# Altium schematic sheet Audio.SchDoc
size A; SheetNumber: 2; SheetTotal: 10
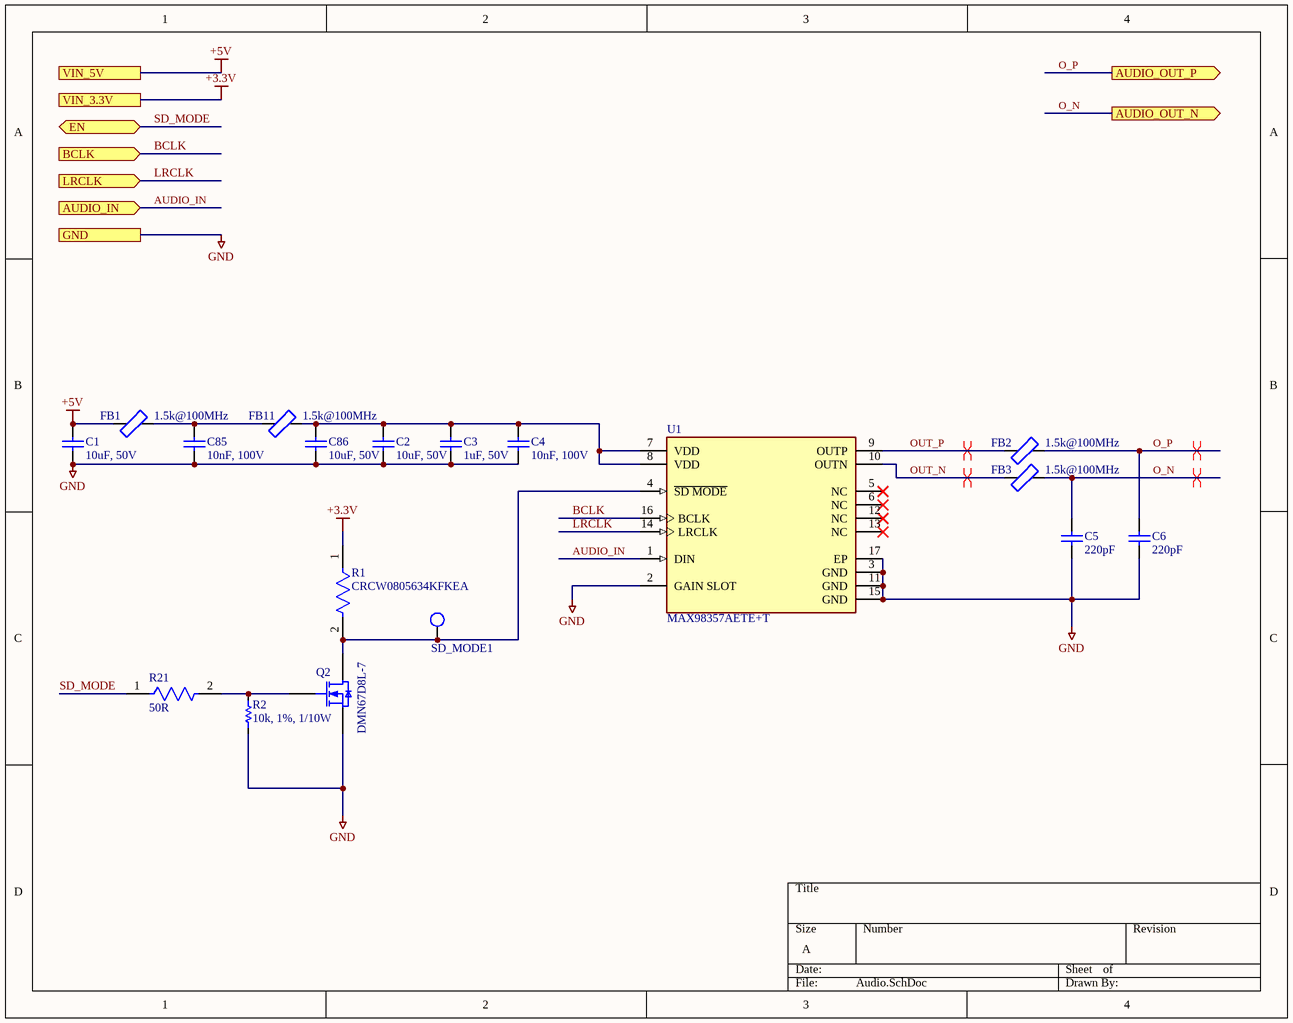
[diagram p0: Audio.SchDoc]

## Parts
C1  10uF, 50V  [1206]
C2  10uF, 50V  [1206]
C3  1uF, 50V  [0805]
C4  10nF, 100V  [0603]
C5  220pF  [CAPC2013X88X50LL20T25]
C6  220pF  [CAPC2013X88X50LL20T25]
C85  10nF, 100V  [0603]
C86  10uF, 50V  [1206]
FB1  1.5k@100MHz  [0805]
FB2  1.5k@100MHz  [0805]
FB3  1.5k@100MHz  [0805]
FB11  1.5k@100MHz  [0805]
Q2  DMN67D8L-7  [SOT23-3]
R1  CRCW0805634KFKEA  [FP-CRCW0805-e3-MFG]
R2  10k, 1%, 1/10W  [0603]
R21  50R  [FP-RCP0603W-MFG]
SD_MODE1  2mm  [TEST POINT 40 Mil]  (value not drawn)  (no BOM)
U1  MAX98357AETE+T  [FP-T1633-4-MFG]

## Ports
AUDIO_IN (in), AUDIO_OUT_N (out), AUDIO_OUT_P (out), BCLK (in), EN (bidir), GND, LRCLK (in), VIN_3.3V, VIN_5V

## Nets
+3.3V: R1.1 ; port VIN_3.3V
+5V: C1.2 FB1.1 ; port VIN_5V
GND: C1.1 C2.1 C3.1 C4.2 C5.1 C6.1 C85.2 C86.1 Q2.2(S) R2.2 U1.2(GAIN_SLOT) U1.3(GND) U1.11(GND) U1.15(GND) U1.17(EP) ; port GND
AUDIO_IN: U1.1(DIN) ; port AUDIO_IN
BCLK: U1.16(BCLK) ; port BCLK
LRCLK: U1.14(LRCLK) ; port LRCLK
O_N: C5.2 FB3.2 ; port AUDIO_OUT_N
O_P: C6.2 FB2.2 ; port AUDIO_OUT_P
OUT_N: FB3.1 U1.10(OUTN)
OUT_P: FB2.1 U1.9(OUTP)
SD_MODE: R21.1 ; port EN
NetC2_2: C2.2 C3.2 C4.1 C86.2 FB11.2 U1.7(VDD) U1.8(VDD)
NetC85_1: C85.1 FB1.2 FB11.1
NetQ2_1: Q2.1(G) R2.1 R21.2
NetQ2_3: Q2.3(D) R1.2 SD_MODE1.1(TP) U1.4(~{SD_MODE})

Not connected (* = marked no-connect by the designer): U1 5(NC)* 6(NC)* 12(NC)* 13(NC)*

## Layout directives
differential pair: O_N, O_P, OUT_N, OUT_P

## Library data of the parts
C1 C2 C86 = NS00832: CAP CER 10UF 50V X7R 1206; Type: C; Alternatives: Generic; Part Number: NS00832; Value: 10uF, 50V; Supplier 1: Digi-Key; Supplier Part Number 1: 1276-6767-1-ND
C3 = NS00871: CAP CER 1UF 50V X7R 0805; Type: C; Alternatives: Generic; Part Number: NS00871; Value: 1uF, 50V; Supplier 1: Digi-Key; Supplier Part Number 1: 1276-6470-1-ND
C4 C85 = NS00848: CAP CER 10000PF 100V C0G 0603; Type: C; Alternatives: Generic; Part Number: NS00848; Value: 10nF, 100V; Supplier 1: Digi-Key; Supplier Part Number 1: 445-172665-1-ND
C5 C6 = CMP-1036-02336-2: Part Number: C0805C221J2GACTU; Manufacturer: Kemet
FB1-FB3 FB11 = NS00881: WE-CBA SMT EMI SUPPRESSION FERRITE; Type: Inductor; Part Number: NS00881; Value: 1.5k@100MHz; ComponentLink1Description: Datasheet; ComponentLink1URL: H:\Doc\Wurth\782853162.pdf; Supplier 1: Digi-Key; Supplier Part Number 1: 732-782853162CT-ND
Q2 = NS00873: MOSFET N-CH 60V 210MA SOT23; Type: IC; Published: 8-Jun-2000; LatestRevisionDate: 17-Jul-2002; LatestRevisionNote: Re-released for DXP Platform.; PackageVersion: 1995/1996; PackageReference: E3; Publisher: Altium Limited; Part Number: NS00873; Value: DMN67D8L-7; ComponentLink1Description: Datasheet; ComponentLink1URL: H:\Doc\Diodes\DMN67D8L.pdf; Supplier 1: Digi-Key; Supplier Part Number 1: DMN67D8L-7DICT-ND
R1 = CMP-1013-00827-2: RES Thick Film, 634kΩ, 1%, 0.125W, 100ppm/°C, 0805; Voltage Rating: 150V; Max Power Dissipation: 125mW; Resistance: 634kR; Weight: 0.000194oz; Max Operating Temperature: 155°C; Case Code (Metric): 2012; Height: 0.02inch; Temperature Coefficient: 100ppm/°C; Power Rating: 125mW; Length: 2mm; Contact Plating: Tin; Package Quantity: 10; Packaging: Tape and Reel; Min Operating Temperature: -55°C; Case Code (Imperial): 0805; Termination: SMD/SMT; Composition: Thick Film; Case/Package: 0805; Lead Free: Lead Free; Voltage Rating (DC): 150V; Width: 0.049inch; Features: Automotive AEC-Q200; Tolerance: 1%; Radiation Hardening: No; Depth: 1.25mm; Military Standard: Not; Number of Terminations: 2; Supplier 1: Digi-Key; Supplier Part Number 1: CRCW0805634KFKEA
R2 = NS00820: RES 10K OHM 1% 1/10W 0603; Alternatives: Generic; Part Number: NS00820; Type: R; Value: 10k, 1%, 1/10W; Supplier 1: Digi-Key; Supplier Part Number 1: RMCF0603FT10K0CT-ND
R21 = CMP-02407-013160-1: RES SMD 50 OHM 2% 1.5W 0603; Max Power Dissipation: 3.9W; Temperature Coefficient: 150ppm/°C; Resistor Type: Thick Film; Case Code (Imperial): 0603; Technology: THICK FILM; Termination: Solder; Width: 0.032inch; Resistance: 50R; Number of Terminations: 2; Mount: Surface Mount; Features: Moisture Resistant; Series: RCP; Depth: 0.81mm; Case/Package: 0603; Max Operating Temperature: 155°C; Power Rating: 3.9W; Min Operating Temperature: -55°C; Case Code (Metric): 1608; Height: 0.023inch; Length: 0.063inch; Tolerance: 2%; Packaging: Cut Tape
SD_MODE1 = NS00254: Testpoint 2mm round; Part Number: NS00254; Type: Mechanical; Value: 2mm
U1 = CMP-05698-000018-1: IC AMP CLASS D MONO 3.2W 16TQFN; Max Supply Voltage: 5.5V; Max Output Current: 1.6A; Voltage Gain: 15dB; Max Power Dissipation: 1.666W; Min Supply Voltage: 2.5V; Power Supply Rejection Ratio (PSRR): 77dB; Series: -; Contact Plating: Tin; Min Operating Temperature: -40°C; Packaging: Tape and Reel; Max Output Power: 3.2W; Mount: Surface Mount; Number of Pins: 16; RoHS Compliant: Yes; Max Operating Temperature: 85°C; Radiation Hardening: No